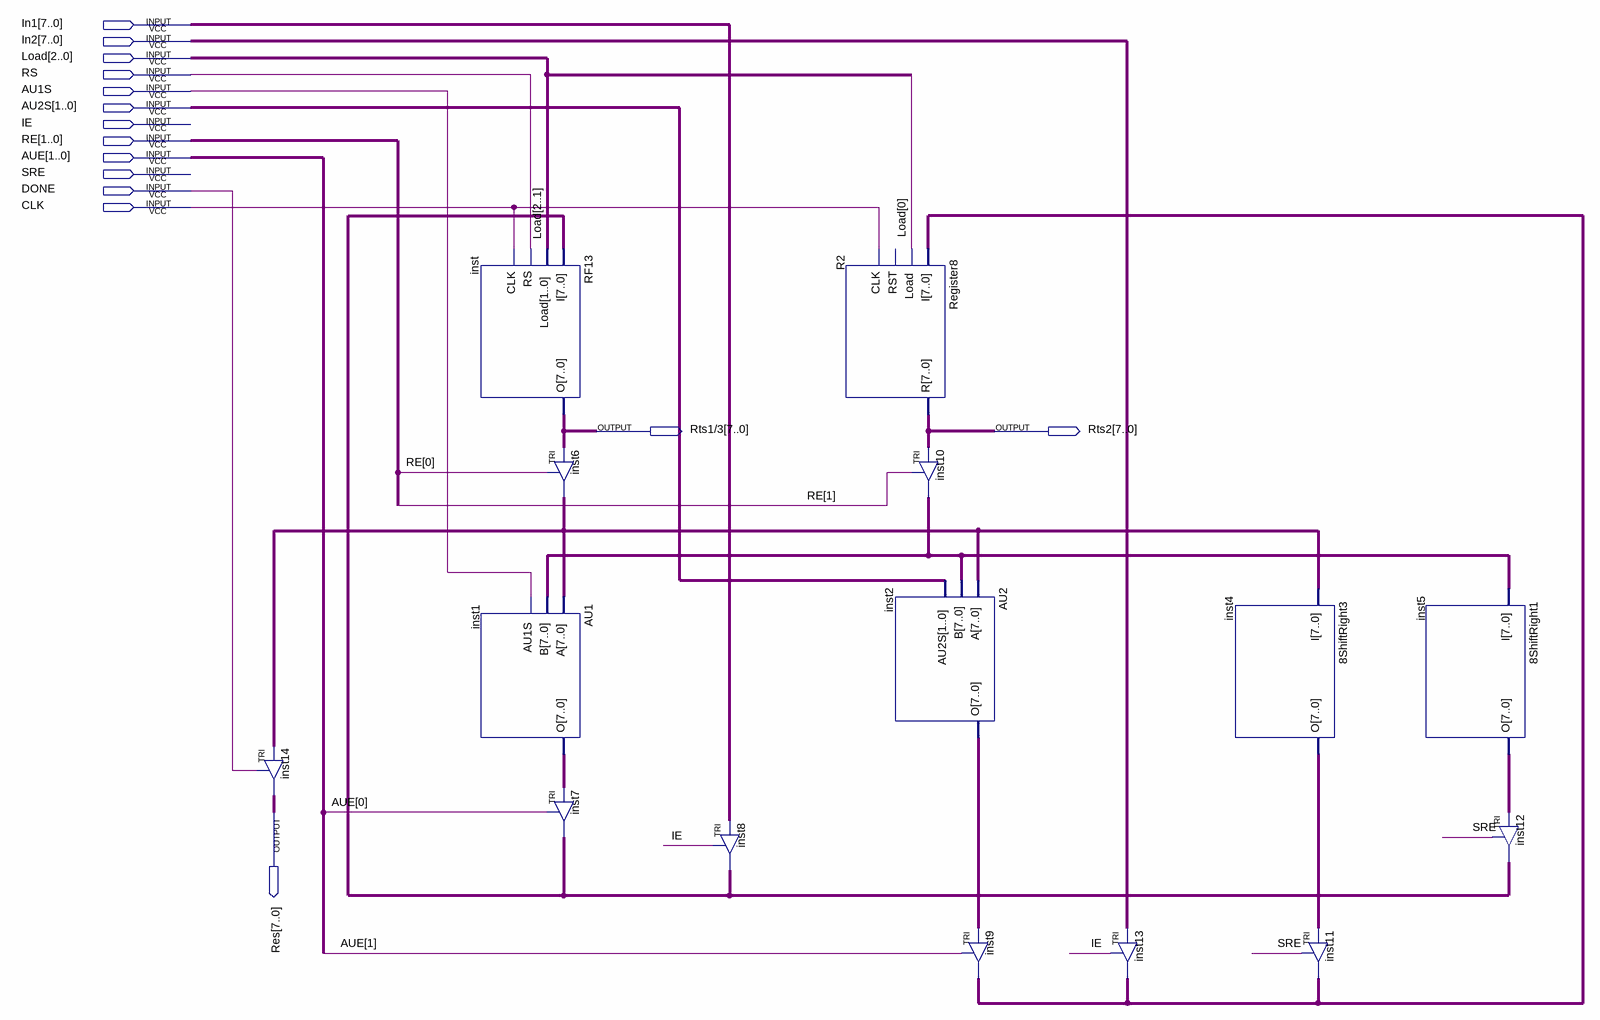
[diagram p0: schematic sheet]
// Quartus schematic Dtp.bdf as structural Verilog: 15 symbols, 15 pins
module Dtp (
  input  [7:0] In1,
  input  [7:0] In2,
  input  [2:0] Load,
  input  RS,
  input  AU1S,
  input  [1:0] AU2S,
  input  IE,
  input  [1:0] RE,
  input  [1:0] AUE,
  input  SRE,
  input  DONE,
  input  CLK,
  output [7:0] \Rts1/3 ,
  output [7:0] Rts2,
  output [7:0] Res
);

  wire [7:0] inst1_o, inst2_o, inst4_o, inst5_o, inst6_out, inst7_out, inst9_out, inst10_out;

  TRI inst14[7:0] (.IN(inst6_out), .OE(DONE), .OUT(Res));
  RF13 inst (.I(inst7_out), .Load(Load[2:1]), .RS(RS), .CLK(CLK), .O(\Rts1/3 ));
  AU1 inst1 (.B(inst10_out), .A(inst6_out), .AU1S(AU1S), .O(inst1_o));
  TRI inst6[7:0] (.IN(\Rts1/3 ), .OE(RE[0]), .OUT(inst6_out));
  TRI inst7[7:0] (.IN(inst1_o), .OE(AUE[0]), .OUT(inst7_out));
  TRI inst8[7:0] (.IN(In1), .OE(IE), .OUT(inst7_out));
  Register8 R2 (.I(inst9_out), .Load(Load[0]), .CLK(CLK), .R(Rts2));  // open: RST
  TRI inst10[7:0] (.IN(Rts2), .OE(RE[1]), .OUT(inst10_out));
  AU2 inst2 (.A(inst6_out), .B(inst10_out), .AU2S(AU2S), .O(inst2_o));
  TRI inst9[7:0] (.IN(inst2_o), .OE(AUE[1]), .OUT(inst9_out));
  TRI inst13[7:0] (.IN(In2), .OE(IE), .OUT(inst9_out));
  \8ShiftRight3  inst4 (.I(inst6_out), .O(inst4_o));
  TRI inst11[7:0] (.IN(inst4_o), .OE(SRE), .OUT(inst9_out));
  \8ShiftRight1  inst5 (.I(inst10_out), .O(inst5_o));
  TRI inst12[7:0] (.IN(inst5_o), .OE(SRE), .OUT(inst7_out));
endmodule
